# Altium schematic sheet 5V EFuse.SchDoc
size A; SheetNumber: 2; SheetTotal: 3
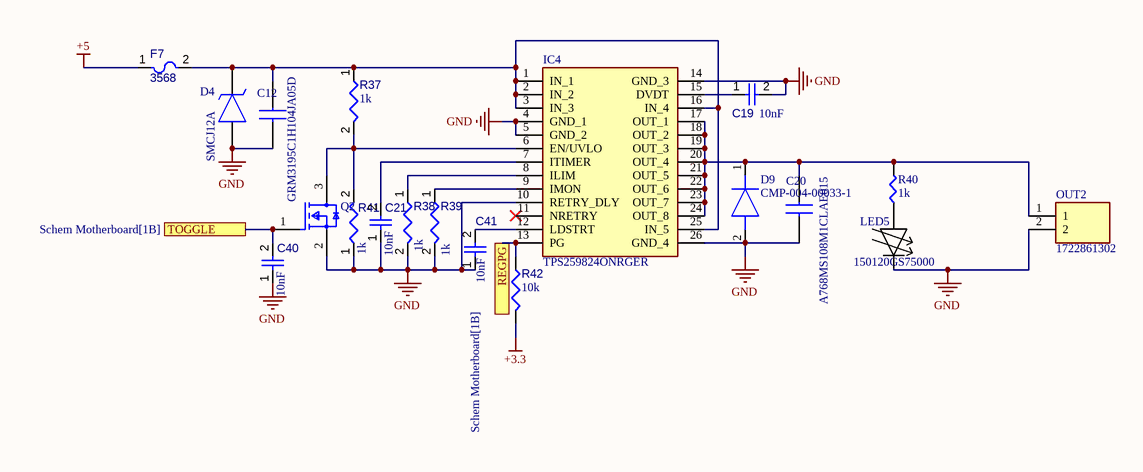
[diagram p0: 5V EFuse.SchDoc]

## Parts
C12  GRM3195C1H104JA05D  [CAPC3216X95N]
C19  value 10nF  [CAPC0402(1005)60_L]  (hidden comment: Capacitor 10nF +/-20% 50V 0402)
C20  A768MS108M1CLAE015  [CAPAE1030X1030N]
C21  value 10nF  [CAPC0402(1005)60_L]  (hidden comment: Capacitor 10nF +/-20% 50V 0402)
C40  value 10nF  [CAPC0402(1005)60_L]  (hidden comment: Capacitor 10nF +/-20% 50V 0402)
C41  value 10nF  [CAPC0402(1005)60_L]  (hidden comment: Capacitor 10nF +/-20% 50V 0402)
D4  SMCJ12A  [SMCJ12A]
D9  CMP-004-00033-1  [DIOM7959X250N]
F7  3568  [KSTN-3568_V]
IC4  TPS259824ONRGER  [TPS259824LNRGER]
LED5  150120GS75000  [150120GS75000]
OUT2  1722861302  [1722861302]
Q2  IRFML8244TRPBF  [FP-PG-SOT23-3-IPC_B]  (value not drawn)
R37  value 1k  [RESC0402(1005)_L]  (hidden comment: MCS0402MD1004BE000)
R38  value 1k  [RESC0402(1005)_L]  (hidden comment: RNCF0402TKY250R)
R39  value 1k  [RESC0402(1005)_L]  (hidden comment: ERA-2AEB2211X)
R40  value 1k  [SMD-1206-RES]  (hidden comment: ERJ-P08J102V)
R41  value 1k  [RESC0402(1005)_L]  (hidden comment: RT0402BRD07137KL)
R42  value 10k  [RESC0402(1005)_L]  (hidden comment: ERA-2AEB103X)

## Ports
REGPG (see Schem Motherboard[1B]), TOGGLE (see Schem Motherboard[1B])

## Nets
+3.3: R42.2
+5: F7.1
GND: C12.2 C19.2 C20.2(-) C21.1 C40.1 C41.1 D4.2(A) D9.2(A) IC4.4(GND_1) IC4.5(GND_2) IC4.10(RETRY_DLY) IC4.14(GND_3) IC4.26(GND_4) LED5.1 OUT2.2 Q2.2(S) R38.2 R39.2 R41.1
REGPG: IC4.13(PG) R42.1 ; port REGPG
TOGGLE: C40.2 Q2.1(G) ; port TOGGLE
NetC12_1: C12.1 D4.1(K) F7.2 IC4.1(IN_1) IC4.2(IN_2) IC4.3(IN_3) IC4.16(IN_4) IC4.25(IN_5) R37.1
NetC19_1: C19.1 IC4.15(DVDT)
NetC20_1: C20.1(+) D9.1(K) IC4.17(OUT_1) IC4.18(OUT_2) IC4.19(OUT_3) IC4.20(OUT_4) IC4.21(OUT_5) IC4.22(OUT_6) IC4.23(OUT_7) IC4.24(OUT_8) OUT2.1 R40.2
NetC21_2: C21.2 IC4.7(ITIMER)
NetC41_2: C41.2 IC4.12(LDSTRT)
NetIC4_6: IC4.6(EN/UVLO) Q2.3(D) R37.2 R41.2
NetIC4_8: IC4.8(ILIM) R38.1
NetIC4_9: IC4.9(IMON) R39.1
NetLED5_2: LED5.2 R40.1

Not connected (* = marked no-connect by the designer): IC4 11(NRETRY)*

## Library data of the parts
C12 = GRM3195C1H104JA05D: Capacitor; Manufacturer_Name: Murata Electronics; Datasheet Link: https://search.murata.co.jp/Ceramy/image/img/A01X/G101/ENG/GRM3195C1H104JA05-01A.pdf; Height: 0.95mm; Manufacturer_Part_Number: GRM3195C1H104JA05D; Mouser Part Number: 81-GRM3195C1H104JA5D; Mouser Price/Stock: https://www.mouser.co.uk/ProductDetail/Murata-Electronics/GRM3195C1H104JA05D?qs=d0WKAl%252BL4KbMHVjEYnUPZQ%3D%3D; Arrow Part Number: GRM3195C1H104JA05D; Arrow Price/Stock: https://www.arrow.com/en/products/grm3195c1h104ja05d/murata-manufacturing?utm_currency=USD&region=nac
C19 C21 C40 C41 = CMP-001-00069-3: Chip Capacitor, 10nF +/-20%, 50V, 0402, Thickness 0.6 mm; Tolerance: 5%; Max Operating Temperature: 85°C; Pins: 2; Case/Package: 0402; Voltage Rating: 50V; Min Operating Temperature: -55°C; Mounting Technology: SMT
C20 = A768MS108M1CLAE015: Capacitor; Manufacturer_Name: KEMET; Datasheet Link: https://connect.kemet.com:7667/gateway/IntelliData-ComponentDocumentation/1.0/download/datasheet/A768MS108M1CLAE015; Height: 10.3mm; Manufacturer_Part_Number: A768MS108M1CLAE015; Mouser Part Number: 80-A768MS108M1CLAE15; Mouser Price/Stock: https://www.mouser.co.uk/ProductDetail/KEMET/A768MS108M1CLAE015?qs=vmHwEFxEFR%252BKkhWLLss77A%3D%3D; Arrow Part Number: A768MS108M1CLAE015; Arrow Price/Stock: null?utm_currency=USD&region=nac
D4 = SMCJ12A: TVS Diode (Uni-directional); Manufacturer_Name: Taiwan Semiconductor; Datasheet Link: https://www.digikey.ph/en/products/detail/littelfuse-inc/SMCJ12A/762376?msockid=39f1ec84d77b6f4428b7f904d6676eed; Manufacturer_Part_Number: SMCJ12A; Mouser Part Number: 821-SMCJ12A; Mouser Price/Stock: https://www.mouser.co.uk/ProductDetail/Taiwan-Semiconductor/SMCJ12A?qs=tHU%2FlV7kTyR77ggsD5GQAA%3D%3D; Arrow Part Number: SMCJ12A; Arrow Price/Stock: https://www.arrow.com/en/products/smcj12a/taiwan-semiconductor?utm_currency=USD&region=europe
D9 = CMP-004-00033-1: Schottky Diodes & Rectifiers 20V 5A; Manufacturer_Name: Diodes Incorporated; Manufacturer_Part_Number: B520C-13-F; Datasheet Link: https://www.mouser.com/datasheet/2/115/ds13012-73423.pdf; Height: 2.5mm; Mouser Part Number: 621-B520C-F; Mouser Price/Stock: https://www.mouser.co.uk/ProductDetail/Diodes-Incorporated/B520C-13-F?qs=M9x7oF%252BgWA8vHz6ClNP3LA%3D%3D; Arrow Part Number: B520C-13-F; Arrow Price/Stock: https://www.arrow.com/en/products/b520c-13-f/diodes-incorporated?utm_currency=USD&region=nac
F7 = CMP-005-00013-2: Fuses/Accessories
IC4 = CMP-031-00019-1: Integrated Circuit; Manufacturer_Name: Texas Instruments; Datasheet Link: https://www.arrow.com/en/products/tps259824onrger/texas-instruments; Height: 1mm; Manufacturer_Part_Number: TPS259824ONRGER; Mouser Part Number: 595-TPS259824ONRGER; Mouser Price/Stock: https://www.mouser.co.uk/ProductDetail/Texas-Instruments/TPS259824ONRGER?qs=uwxL4vQweFP%252BNWypnqUI5Q%3D%3D; Arrow Part Number: TPS259824ONRGER; Arrow Price/Stock: https://www.arrow.com/en/products/tps259824onrger/texas-instruments?region=nac
LED5 = CMP-036-000001-1: Green Status LED 1206; Source: LED - Chip.SchLib; Design Item ID: 150120GS75000; ComponentLink1Description: Schematic; ComponentLink1URL: https://katalog.we-online.de/led/datasheet/150120GS75000.pdf
OUT2 = 1722861302: Connector; Manufacturer_Name: Molex; Datasheet Link: https://www.molex.com/en-us/products/part-detail-pdf/1722861302?display=pdf; Height: 14.5mm; Manufacturer_Part_Number: 1722861302; Arrow Part Number: 1722861302; Arrow Price/Stock: https://www.arrow.com/en/products/172286-1302/molex
Q2 = CMP-013-00037-1: Power Field-Effect Transistor, 5.8A I(D), 25V, 0.024ohm, 1-Element, N-Channel, Silicon, Metal-oxide Semiconductor FET, TO-236AB; Number of Elements: 1; Package Body Material: Plastic; Time @ Peak Reflow Temperature-Max (s): 30s; Operating Mode: ENHANCEMENT MODE; Pulsed Drain Current-Max (IDM): 24A; Qualification Status: Not Qualified; Transistor Application: SWITCHING; Power Dissipation-Max (Abs): 1.25W; Drain-source On Resistance-Max: 24mR; RoHS Compliant: Yes; JESD-609 Code: e3; Terminal Finish: Tin; Drain Current-Max (Abs) (ID): 5.8A; Drain Current-Max (ID): 5.8A; Reach SVHC Compliant: Yes; Transistor Element Material: SILICON; Max Operating Temperature: 150°C; Terminal Form: Gull Wing; Moisture Sensitivity Level: 1; Package Shape: Rectangular; Surface Mount: Yes; DS Breakdown Voltage-Min: 25V; Peak Reflow Temperature (Cel): 260°C; Polarity/Channel Type: N-CHANNEL; FET Technology: METAL-OXIDE SEMICONDUCTOR; JEDEC-95 Code: TO-236AB; JESD-30 Code: R-PDSO-G3; Pins: 3; Package Style: SMALL OUTLINEMeter; Terminal Position: DUAL
R37-R39 R41 = CMP-009-00075-2: 1K 0.063W 5% 0402 (1005 Metric)  SMD; Power: 63mW; Pins: 2; Mounting Technology: SMT; Case/Package: 0402; Tolerance: 5%
R40 = CMP-053-001023-1: RES SMD 1K OHM 5% 2/3W 1206; Manufacturer: Panasonic Electronic Components; Power (Watts): 0.667W, 2/3W; Temperature Coefficient: ±200ppm/°C; Factory Stock: 0; Unit Price (USD): 0.02178; @ qty: 1500; Minimum Quantity: 1; Digi-Key Part Number: P1.0KALCT-ND; Package / Case: 1206 (3216 Metric); Datasheets: https://industrial.panasonic.com/cdbs/www-data/pdf/RDA0000/AOA0000C243.pdf; Part Number: ERJ-P08J102V; Packaging: Cut Tape (CT); Height - Seated (Max): 0.028" (0.70mm); Number of Terminations: 2; Image: //media.digikey.com/Renders/Panasonic%20Renders/ERJ-1206%20Pkg.jpg; Source: Panasonic_ERJ_1206.SchLib; Quantity Available: 85126; Features: Automotive AEC-Q200, Pulse Withstanding; Design Item ID: ERJ-P08J102V; Tolerance: ±5%; Supplier Device Package: 1206; Part Status: Active; Failure Rate: -; Size / Dimension: 0.126" L x 0.063" W (3.20mm x 1.60mm); Series: ERJ; Operating Temperature: -55°C ~ 155°C; Pin Count: 2; Component Type: Standard; Composition: Thick Film
R42 = CMP-009-00075-2: 10 kOhms ±0.1% 0.063W, 1/16W Chip Resistor 0402 (1005 Metric) Automotive AEC-Q200 Thin Film; Power: 63mW; Tolerance: 5%; Pins: 2; Mounting Technology: SMT; Case/Package: 0402